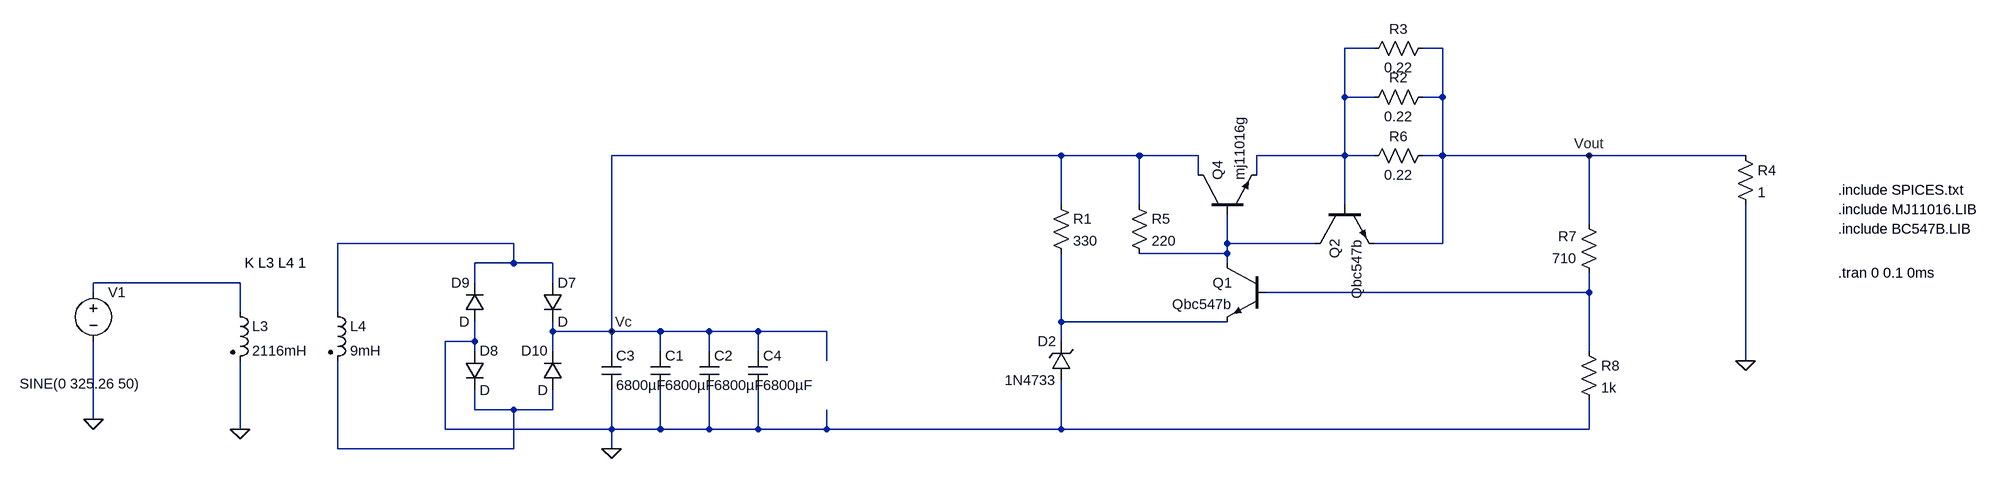
[diagram p0: schematic with_current_limitter.asc]
with_current_limitter.asc, the LTspice schematic file:
Version 4
SHEET 1 2968 1604
WIRE 1808 544 1760 544
WIRE 1920 544 1888 544
WIRE 1760 624 1760 544
WIRE 1808 624 1760 624
WIRE 1920 624 1920 544
WIRE 1920 624 1888 624
WIRE 1296 720 560 720
WIRE 1424 720 1296 720
WIRE 1520 720 1424 720
WIRE 1760 720 1760 624
WIRE 1760 720 1616 720
WIRE 1808 720 1760 720
WIRE 1920 720 1920 624
WIRE 1920 720 1888 720
WIRE 2160 720 1920 720
WIRE 2416 720 2160 720
WIRE 1520 752 1520 720
WIRE 1616 752 1616 720
WIRE 1296 800 1296 720
WIRE 1424 800 1424 720
WIRE 1760 800 1760 720
WIRE 2160 832 2160 720
WIRE 400 864 112 864
WIRE 1568 864 1568 816
WIRE 1712 864 1568 864
WIRE 1920 864 1920 720
WIRE 1920 864 1808 864
WIRE 1568 880 1568 864
WIRE 1568 880 1424 880
WIRE 400 896 400 864
WIRE 400 896 336 896
WIRE 464 896 400 896
WIRE 1568 896 1568 880
WIRE -48 928 -288 928
WIRE 336 928 336 896
WIRE 464 928 464 896
WIRE -288 944 -288 928
WIRE 2160 944 2160 912
WIRE 2160 944 1632 944
WIRE -48 976 -48 928
WIRE 112 976 112 864
WIRE 1296 992 1296 880
WIRE 1568 992 1296 992
WIRE 464 1008 464 992
WIRE 560 1008 560 720
WIRE 560 1008 464 1008
WIRE 640 1008 560 1008
WIRE 720 1008 640 1008
WIRE 800 1008 720 1008
WIRE 912 1008 800 1008
WIRE 336 1024 336 992
WIRE 336 1024 288 1024
WIRE 1296 1024 1296 992
WIRE 336 1040 336 1024
WIRE 464 1040 464 1008
WIRE 560 1040 560 1008
WIRE 640 1040 640 1008
WIRE 720 1040 720 1008
WIRE 800 1040 800 1008
WIRE 2160 1040 2160 944
WIRE 912 1056 912 1008
WIRE 2416 1056 2416 800
WIRE 336 1136 336 1104
WIRE 400 1136 336 1136
WIRE 464 1136 464 1104
WIRE 464 1136 400 1136
WIRE -288 1152 -288 1024
WIRE -48 1168 -48 1056
WIRE 288 1168 288 1024
WIRE 560 1168 560 1104
WIRE 560 1168 288 1168
WIRE 640 1168 640 1104
WIRE 640 1168 560 1168
WIRE 720 1168 720 1104
WIRE 720 1168 640 1168
WIRE 800 1168 800 1104
WIRE 800 1168 720 1168
WIRE 912 1168 912 1136
WIRE 912 1168 800 1168
WIRE 1296 1168 1296 1088
WIRE 1296 1168 912 1168
WIRE 2160 1168 2160 1120
WIRE 2160 1168 1296 1168
WIRE 112 1200 112 1056
WIRE 400 1200 400 1136
WIRE 400 1200 112 1200
WIRE 560 1200 560 1168
FLAG -288 1152 0
FLAG -48 1168 0
FLAG 560 1200 0
FLAG 2416 1056 0
FLAG 2160 720 Vout
FLAG 560 1008 Vc
SYMBOL voltage -288 928 R0
WINDOW 123 0 0 Left 0
WINDOW 39 0 0 Left 0
WINDOW 3 -121 166 Left 2
SYMATTR Value SINE(0 325.26 50)
SYMATTR InstName V1
SYMBOL ind2 -64 960 R0
SYMATTR InstName L3
SYMATTR SpiceLine Rser=0.001
SYMATTR Value 2116mH
SYMATTR Type ind
SYMBOL ind2 96 960 R0
SYMATTR InstName L4
SYMATTR Value 9mH
SYMATTR Type ind
SYMBOL diode 448 928 R0
SYMATTR InstName D7
SYMBOL diode 320 1040 R0
SYMATTR InstName D8
SYMBOL diode 352 992 R180
WINDOW 0 24 64 Left 2
WINDOW 3 24 0 Left 2
SYMATTR InstName D9
SYMBOL diode 480 1104 R180
WINDOW 0 24 64 Left 2
WINDOW 3 24 0 Left 2
SYMATTR InstName D10
SYMBOL cap 544 1040 R0
SYMATTR InstName C3
SYMATTR Value 6800µF
SYMBOL npn 1520 816 R270
SYMATTR InstName Q4
SYMATTR Value mj11016g
SYMATTR Prefix X
SYMBOL res 1408 784 R0
SYMATTR InstName R5
SYMATTR Value 220
SYMBOL res 1904 704 R90
WINDOW 0 0 56 VBottom 2
WINDOW 3 32 56 VTop 2
SYMATTR InstName R6
SYMATTR Value 0.22
SYMBOL res 2176 928 R180
WINDOW 0 36 76 Left 2
WINDOW 3 36 40 Left 2
SYMATTR InstName R7
SYMATTR Value 710
SYMBOL res 2144 1024 R0
SYMATTR InstName R8
SYMATTR Value 1k
SYMBOL res 1280 784 R0
SYMATTR InstName R1
SYMATTR Value 330
SYMBOL zener 1312 1088 R180
WINDOW 0 24 64 Left 2
WINDOW 3 24 0 Left 2
SYMATTR InstName D2
SYMATTR Value 1N4733
SYMBOL npn 1632 896 M0
SYMATTR InstName Q1
SYMATTR Value Qbc547b
SYMATTR Prefix Q
SYMBOL npn 1712 800 M90
SYMATTR InstName Q2
SYMATTR Value Qbc547b
SYMATTR Prefix Q
SYMBOL res 1904 608 R90
WINDOW 0 0 56 VBottom 2
WINDOW 3 32 56 VTop 2
SYMATTR InstName R2
SYMATTR Value 0.22
SYMBOL res 1904 528 R90
WINDOW 0 0 56 VBottom 2
WINDOW 3 32 56 VTop 2
SYMATTR InstName R3
SYMATTR Value 0.22
SYMBOL cap 624 1040 R0
SYMATTR InstName C1
SYMATTR Value 6800µF
SYMBOL cap 704 1040 R0
SYMATTR InstName C2
SYMATTR Value 6800µF
SYMBOL cap 784 1040 R0
SYMATTR InstName C4
SYMATTR Value 6800µF
SYMBOL res 2400 704 R0
SYMATTR InstName R4
SYMATTR Value 1
TEXT -40 896 Left 2 !K L3 L4 1
TEXT 2568 776 Left 2 !.include SPICES.txt
TEXT 2568 808 Left 2 !.include MJ11016.LIB
TEXT 2568 840 Left 2 !.include BC547B.LIB
TEXT 2568 912 Left 2 !.tran 0 0.1 0ms

The netlist it stands for:
* with_current_limitter.asc
V1 N004 0 SINE(0 325.26 50)
L3 N004 0 2116mH Rser=0.001
L4 N002 N007 9mH
D7 N002 Vc D
D8 0 N007 D
D9 0 N002 D
D10 N007 Vc D
C3 Vc 0 6800µF
XQ4 Vc N003 N001 mj11016g  ; pins C B E
R5 Vc N003 220
R6 Vout N001 0.22
R7 N005 Vout 710
R8 N005 0 1k
R1 Vc N006 330
D2 0 N006 1N4733
Q1 N003 N005 N006 0 Qbc547b
Q2 N003 N001 Vout 0 Qbc547b
R2 Vout N001 0.22
R3 Vout N001 0.22
C1 Vc 0 6800µF
C2 Vc 0 6800µF
C4 Vc 0 6800µF
R4 Vout 0 1
.model D D
.lib standard.dio
.model NPN NPN
.model PNP PNP
.lib standard.bjt
K L3 L4 1
.include SPICES.txt
.include MJ11016.LIB
.include BC547B.LIB
.tran 0 0.1 0ms
.backanno
.end

* Results of the author's LTspice run, read from the files saved beside the schematic
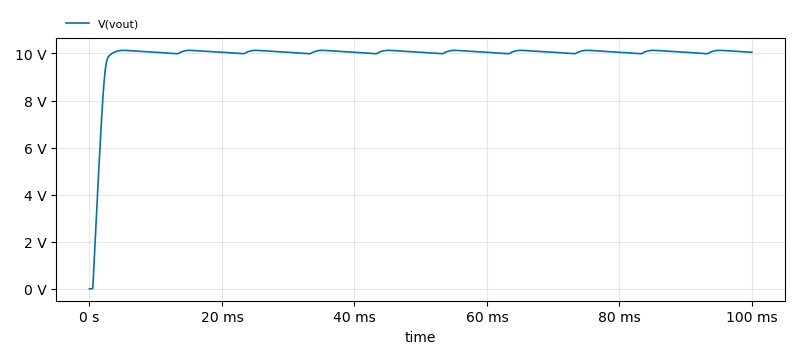
[diagram p1: Transient Analysis of with_current_limitter.asc, plotted from the saved traces]
* Transient Analysis, 1 run:
*   V(vout): min 0 V, max 10.13 V, average 9.923 V, rms 9.979 V, last 10.05 V